# Altium schematic sheet 09.RST_WDT_CAT823.SchDoc
size A4; CompanyName: 广州致远电子有限公司; DocumentNumber: 8; SheetNumber: 8; SheetTotal: 8; PageSetup: Record=PageOptions|CenterHorizontal=True|CenterVertical=True|PrintScale=1.00|XCorrection=1.00|YCorrection=1.00|PrintKind=0|BorderSize=5000000|LeftOffset=0|BottomOffset=0|Orientation=2|PaperLength=1000|PaperWidth=1000|Scale=100|PaperSource=7|PrintQuality=600|MediaType=1|DitherType=10|PaperKind=A4|PrintScaleMode=1; DesignDate: 2015-07-29; CheckDate: 2015-07-29; SheetName: CAT823; SheetVersion: V1.00; SheetDescription: CAT823
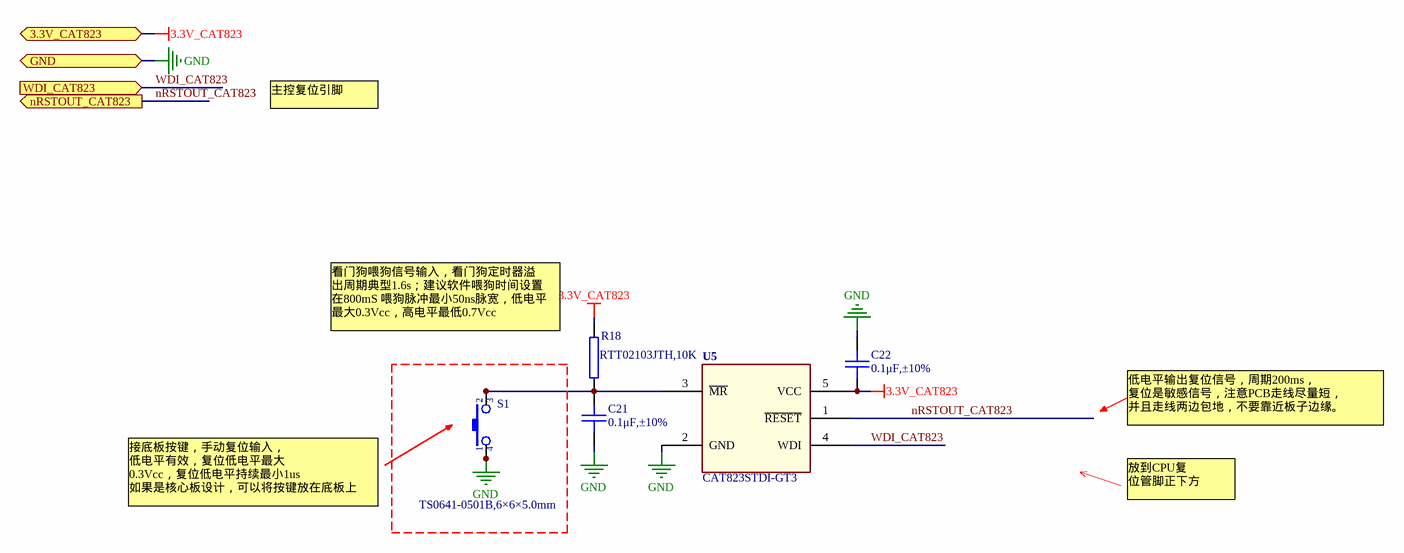
[diagram p0: 09.RST_WDT_CAT823.SchDoc]

## Parts
C21  0.1μF,±10%  [0402C]
C22  0.1μF,±10%  [0402C]
R18  RTT02103JTH,10K  [0402R]
S1  TS0641-0501B,6×6×5.0mm  [KEY-6S]
U5  CAT823STDI-GT3  [SOT-23-5]

## Ports
3.3V_CAT823, GND, nRSTOUT_CAT823 (out), WDI_CAT823 (in)

## Nets
3.3V_CAT823: C22.2 R18.1 U5.5(VCC) ; port 3.3V_CAT823
GND: C21.2 C22.1 S1.1 S1.4 U5.2(GND) ; port GND
nRSTOUT_CAT823: U5.1(~{RESET}) ; port nRSTOUT_CAT823
WDI_CAT823: U5.4(WDI) ; port WDI_CAT823
NetC21_1: C21.1 R18.2 S1.2 S1.3 U5.3(~{MR})

## Notes on the sheet
- 主控复位引脚
- (near R18) 看门狗喂狗信号输入，看门狗定时器溢
  出周期典型1.6s；建议软件喂狗时间设置
  在800mS 喂狗脉冲最小50ns脉宽，低电平
  最大0.3Vcc，高电平最低0.7Vcc
- 低电平输出复位信号，周期200ms，
  复位是敏感信号，注意PCB走线尽量短，
  并且走线两边包地，不要靠近板子边缘。
- 接底板按键，手动复位输入，
  低电平有效，复位低电平最大
  0.3Vcc，复位低电平持续最小1us
  如果是核心板设计，可以将按键放在底板上
- 放到CPU复
  位管脚正下方
- 1
- #
- 修改日期
- 修改内容
- 2
- 3
- 设计人员
- 审核人员
- 设计日期
- 审核日期
- 产品名称
- 图纸名称
- 产品型号
- 图纸描述
- 图纸版本
- A4

## Library data of the parts
C21 C22 = 1.02.17.0006: GRM155R71C104KA88D,0.1μF,±10%,16V,X7R,0402,muRata,RoHS; 名称: 电容; 封装: 0402; 设备封装名称: C0402_0.1uF_X7R_16V_10%; 贴片和直插: SMT; 器件优选方案: 正常状态，可以选用; 物料代码: 1.02.17.0006; Value: 0.1μF,±10%; 厂商: muRata; RoHS: RoHS; 型号: 0.1μF,±10%,16V,X7R; ComponentLink1Description: ErpDataInfo; ComponentLink1URL: http://erp.zlgmcu.com/ErpExt/ErpData/ListMateriel.aspx?pkey=1.02.17.0006
R18 = 1.01.17.0006: RTT02103JTH,10K,±5%,0402,RALEC,RoHS; 名称: 电阻; 封装: 0402; 设备封装名称: R0402_10K; 贴片和直插: SMT; 器件优选方案: 正常状态，可以选用; 物料代码: 1.01.17.0006; Value: RTT02103JTH,10K; 厂商: RALEC; RoHS: RoHS; 型号: RTT02103JTH,10K,±5%; ComponentLink1Description: ErpDataInfo; ComponentLink1URL: http://erp.zlgmcu.com/ErpExt/ErpData/ListMateriel.aspx?pkey=1.01.17.0006
S1 = 1.09.01.0003: TS0641-0501B,6×6×5.0mm,黑色,SMD,卷带装,RoHS; 名称: 轻触开关; 贴片和直插: SMT; 器件优选方案: 正常状态，可以选用; 物料代码: 1.09.01.0003; Value: TS0641-0501B,6×6×5.0mm; 型号: TS0641-0501B,6×6×5.0mm,黑色,SMD,卷带装; ComponentLink1Description: ErpDataInfo; ComponentLink1URL: http://erp.zlgmcu.com/ErpExt/ErpData/ListMateriel.aspx?pkey=1.09.01.0003; RoHS: RoHS
U5 = CAT823: 1.05.07.0025; 物料代码: 1.05.07.0025